# Altium schematic sheet Input_Conditioner.SchDoc
size A4; SheetNumber: 6; SheetTotal: 10
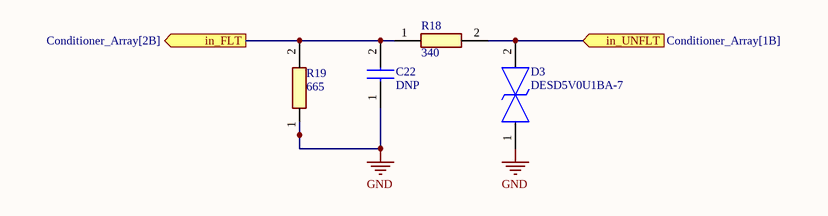
[diagram p0: Input_Conditioner.SchDoc]

## Parts
C22  DNP  [CAPC1608X90N]
D3  DESD5V0U1BA-7  [SOD2513X120N]
R18  340  [RESC1608X55N]
R19  665  [RESC1608X55N]

## Ports
in_FLT (out, see Conditioner_Array[2B]), in_UNFLT (in, see Conditioner_Array[1B])

## Nets
GND: C22.1 D3.1 R19.1
in_FLT: C22.2 R18.1 R19.2 ; port in_FLT
in_UNFLT: D3.2 R18.2 ; port in_UNFLT

## Library data of the parts
C22 = CL10B225KP8NNNC: Manufacturer_Name: SAMSUNG; Datasheet Link: https://datasheet.datasheetarchive.com/originals/distributors/Datasheets-DGA10/2411679.pdf; Height: 0.9mm; Manufacturer_Part_Number: CL10B225KP8NNNC; Mouser Part Number: 187-CL10B225KP8NNNC; Mouser Price/Stock: https://www.mouser.co.uk/ProductDetail/Samsung-Electro-Mechanics/CL10B225KP8NNNC?qs=X6jEic%2FHinDbk4bW6Red9A%3D%3D; Arrow Part Number: CL10B225KP8NNNC; Arrow Price/Stock: https://www.arrow.com/en/products/cl10b225kp8nnnc/samsung-electro-mechanics?region=nac
D3 = DESD5V0U1BA-7: TVS Diode (Bi-directional); Manufacturer_Name: Diodes Incorporated; Datasheet Link: https://www.diodes.com//assets/Datasheets/DESD5V0U1BA.pdf; Height: 1.2mm; Manufacturer_Part_Number: DESD5V0U1BA-7; Mouser Part Number: 621-DESD5V0U1BA-7; Mouser Price/Stock: https://www.mouser.co.uk/ProductDetail/Diodes-Incorporated/DESD5V0U1BA-7?qs=wtVJq%252Be05r98RUWcs2LyvQ%3D%3D; Arrow Part Number: DESD5V0U1BA-7; Arrow Price/Stock: https://www.arrow.com/en/products/desd5v0u1ba-7/diodes-incorporated?region=nac
R18 = RC0603FR-07340RL: Manufacturer_Name: KEMET; Datasheet Link: http://www.yageo.com/documents/recent/PYu-RC0603_51_RoHS_L_v5.pdf; Height: 0.55mm; Manufacturer_Part_Number: RC0603FR-07340RL
R19 = RC0603FR-07665RL: Manufacturer_Name: KEMET; Datasheet Link: http://www.yageo.com/documents/recent/PYu-RC0603_51_RoHS_L_v5.pdf; Height: 0.55mm; Manufacturer_Part_Number: RC0603FR-07665RL; Mouser Part Number: 603-RC0603FR-07665RL; Mouser Price/Stock: https://www.mouser.com/Search/Refine.aspx?Keyword=603-RC0603FR-07665RL